# Altium schematic sheet in_out.SchDoc
size A3; SheetNumber: 2; SheetTotal: 2; SPICEModelCacheBOWUJFQP: <root> / <DocumentId>BOWUJFQP</DocumentId> / </root>
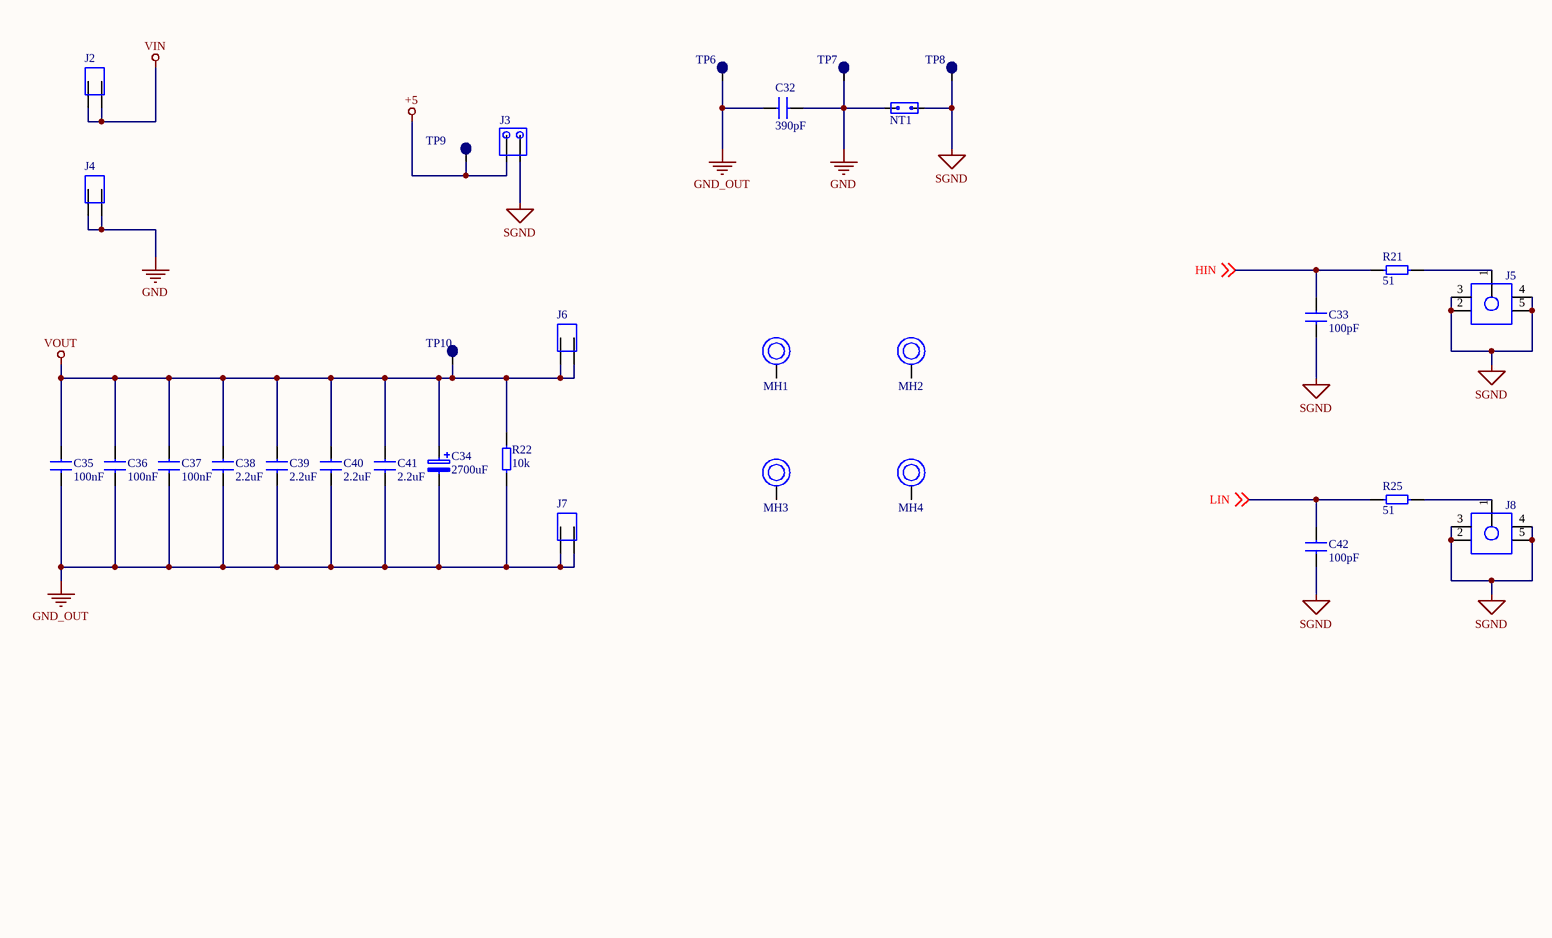
[diagram p0: in_out.SchDoc]

## Parts
C32  390pF  [Capacitor_1812]
C33  100pF  [Capacitor_0805]
C34  2700uF  [Capacitor_Electrolytic_Vib_Res]
C35  100nF  [Capacitor_0805]
C36  100nF  [Capacitor_0805]
C37  100nF  [Capacitor_0805]
C38  2.2uF  [Capcitor_1206]
C39  2.2uF  [Capcitor_1206]
C40  2.2uF  [Capcitor_1206]
C41  2.2uF  [Capcitor_1206]
C42  100pF  [Capacitor_0805]
J2  1289-STR  [1289STR]  (value not drawn)
J3  Connector_3.5mm  [Connector_3.5]  (value not drawn)
J4  1289-STR  [1289STR]  (value not drawn)
J5  142-0701-301  [1420701301]  (value not drawn)
J6  1289-STR  [1289STR]  (value not drawn)
J7  1289-STR  [1289STR]  (value not drawn)
J8  142-0701-301  [1420701301]  (value not drawn)
MH1  Mounting_Hole_M3  [Mounting_Hole_M3]  (value not drawn)  (no BOM)
MH2  Mounting_Hole_M3  [Mounting_Hole_M3]  (value not drawn)  (no BOM)
MH3  Mounting_Hole_M3  [Mounting_Hole_M3]  (value not drawn)  (no BOM)
MH4  Mounting_Hole_M3  [Mounting_Hole_M3]  (value not drawn)  (no BOM)
NT1  Net tie  [Net tie]  (value not drawn)  (net tie, no BOM)
R21  51  [Resistor_0805]
R22  10k  [Resistor_1206]
R25  51  [Resistor_0805]
TP6  Test point  [Test point]  (value not drawn)  (no BOM)
TP7  Test point  [Test point]  (value not drawn)  (no BOM)
TP8  Test point  [Test point]  (value not drawn)  (no BOM)
TP9  Test point  [Test point]  (value not drawn)  (no BOM)
TP10  Test point  [Test point]  (value not drawn)  (no BOM)

## Nets
+5: J3.2 TP9.1
GND: C32.2 J4.1 J4.2 NT1.1 TP7.1
GND_OUT: C32.1 C34.2 C35.1 C36.1 C37.1 C38.1 C39.1 C40.1 C41.1 J7.1 J7.2 R22.1 TP6.1
SGND: C33.1 C42.1 J3.1 J5.2 J5.3 J5.4 J5.5 J8.2 J8.3 J8.4 J8.5 NT1.2 TP8.1
VIN: J2.1 J2.2
VOUT: C34.1 C35.2 C36.2 C37.2 C38.2 C39.2 C40.2 C41.2 J6.1 J6.2 R22.2 TP10.1
HIN: C33.2 R21.1 ; off-sheet HIN
LIN: C42.2 R25.1 ; off-sheet LIN
NetJ5_1: J5.1 R21.2
NetJ8_1: J8.1 R25.2

Not connected (* = marked no-connect by the designer): MH1 1; MH2 1; MH3 1; MH4 1

## Library data of the parts
C32 = Capacitor_1812: Capacitor - Standard SMD; MPN: 1812B391K202CT; Voltage: 2kV; Capacitance: 390pF
C33 C42 = Capacitor_0805: Capacitor - Standard SMD; Voltage: 12V; Capacitance: 100pF; MPN: *
C34 = Capacitor_Electrolytic_Vib_Res: Capacitor - Electrolytic  SMD; Voltage: 35V; Capacitance: 2700uF; MPN: *
C35-C37 = Capacitor_0805: Capacitor - Standard SMD; MPN: CL21B104KBCNNND; Voltage: 50V; Capacitance: 100nF
C38-C41 = Capacitor_1206: Capacitor - Standard SMD; MPN: CL31B225KBHNFNE; Voltage: 50V; Capacitance: 2.2uF
J2 J4 J6 J7 = 1289-STR: Connector; Manufacturer_Name: Keystone Electronics; Datasheet Link: https://www.mouser.com/datasheet/2/215/Keystone_Electronics_12182018_1289-ST-1510776.pdf; Height: 14.37mm; Manufacturer_Part_Number: 1289-STR; Mouser Part Number: 534-1289-STR; Mouser Price/Stock: https://www.mouser.co.uk/ProductDetail/Keystone-Electronics/1289-STR?qs=0lSvoLzn4L%252BMUIbPVNHg8g%3D%3D
J5 J8 = 142-0701-301: Connector; Manufacturer_Name: Cinch Connectivity Solutions; Arrow Price/Stock: https://www.arrow.com/en/products/142-0701-301/cinch-connectivity-solutions?region=nac; Source: KN_ECART.SchLib; Design Item ID: 142-0701-301; Datasheet Link: https://datasheet.datasheetarchive.com/originals/distributors/Datasheets_SAMA/2ec9b041f970d014d2778887508fd87c.pdf; Height: 9.779mm; Mouser Price/Stock: https://www.mouser.co.uk/ProductDetail/Johnson-Cinch-Connectivity-Solutions/142-0701-301?qs=VqHsQWpF6un5h9kBF%252BTxDw%3D%3D; Mouser Part Number: 530-142-0701-301; Manufacturer_Part_Number: 142-0701-301; Arrow Part Number: 142-0701-301
R21 R25 = Resistor_0805: Resistor - Standard SMD; Resistance: 51; Power rate: *; MPN: *
R22 = Resistor_1206: Resistor - Standard SMD; Resistance: 10k; Power rate: *; MPN: *
J3 = Connector_3.5mm: Value: *; HelpURL: *; MPN: *